# EAGLE design Mini-Mixer (EAGLE 7.2.0)
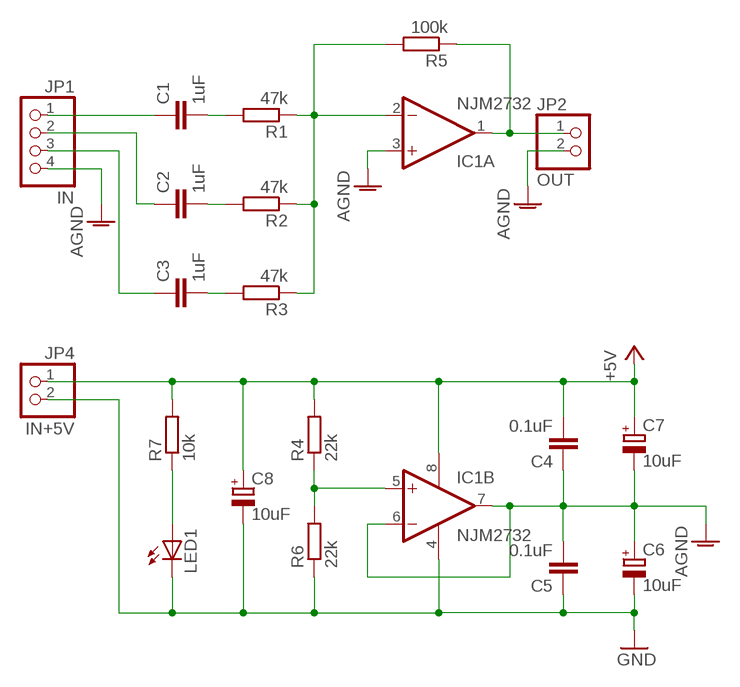
[diagram p0: schematic, sheet 1]

## Parts
C1  1uF  C-EU050-050X075  [C050-050X075]
C2  1uF  C-EU050-050X075  [C050-050X075]
C3  1uF  C-EU050-050X075  [C050-050X075]
C4  0.1uF  C-EU025-024X044  [C025-024X044]
C5  0.1uF  C-EU025-024X044  [C025-024X044]
C6  10uF  CPOL-EUTT2D4L  [TT2D4L]
C7  10uF  CPOL-EUTT2D4L  [TT2D4L]
C8  10uF  CPOL-EUTT2D4L  [TT2D4L]
IC1  NJM2732  LM4558N  [DIL08]
JP1  IN  PINHD-1X4  [1X04]
JP2  OUT  PINHD-1X2  [1X02]
JP4  IN+5V  PINHD-1X2  [1X02]
LED1  LED3MM  [LED3MM]
R1  47k  R-EU_0207/7  [0207/7]
R2  47k  R-EU_0207/7  [0207/7]
R3  47k  R-EU_0207/7  [0207/7]
R4  22k  R-EU_0207/7  [0207/7]
R5  100k  R-EU_0207/7  [0207/7]
R6  22k  R-EU_0207/7  [0207/7]
R7  10k  R-EU_0207/7  [0207/7]

## Nets
+5V: C4.2 C7.+ C8.+ IC1.8(P:V+) JP4.1 R4.2 R7.2
AGND: C4.1 C5.2 C6.+ C7.- IC1.3(A:+IN) IC1.6(B:-IN) IC1.7(B:OUT) JP1.4 JP2.2
GND: C5.1 C6.- C8.- IC1.4(P:V-) JP4.2 LED1.K(C) R6.1
N$1: C1.1 JP1.1
N$2: C2.1 JP1.2
N$3: C3.1 JP1.3
N$4: C1.2 R1.2
N$5: C2.2 R2.2
N$6: C3.2 R3.2
N$7: IC1.2(A:-IN) R1.1 R2.1 R3.1 R5.2
N$8: LED1.A R7.1
N$9: IC1.1(A:OUT) JP2.1 R5.1
N$11: IC1.5(B:+IN) R4.1 R6.2

## Library data of the parts
C1-C5 = rcl:C-EU: CAPACITOR, European symbol
C6-C8 = rcl:CPOL-EU: POLARIZED CAPACITOR, European symbol
IC1 = linear:*4558: OP AMP
JP1 = pinhead:PINHD-1X4: PIN HEADER
JP2 JP4 = pinhead:PINHD-1X2: PIN HEADER
LED1 = led:LED: LED OSRAM: - CHIPLED LG R971, LG N971, LY N971, LG Q971, LY Q971, LO R971, LY R971 LH N974, LH R974 LS Q976, LO Q976, LY Q976 LO Q996 - Hyper CHIPLED LW Q18S LB Q993, LB Q99A, LB R99A - SideLED LS A670, LO A670, LY A670, LG A670, LP A670 LB A673, LV A673, LT A673, LW A673 LH A674 LY A675 LS A676, LA A676, LO A676, LY A676, LW A676 LS A679, LY A679, LG A679 - Hyper Micro SIDELED® LS Y876, LA Y876, LO Y876, LY Y876 LT Y87S - SmartLED LW L88C, LW L88S LB L89C, LB L89S, LG L890 LS L89K, LO L89K, LY L89K LS L896, LA L896, LO L896, LY L896 - TOPLED LS T670, LO T670, LY T670, LG T670, LP T670 LSG T670, LSP T670, LSY T670, LOP T670, LYG T670 LG T671, LOG T671, LSG T671 LB T673, LV T673, LT T673, LW T673 LH T674 LS T676, LA T676, LO T676, LY T676, LB T676, LH T676, LSB T676, LW T676 LB T67C, LV T67C, LT T67C, LS T67K, LO T67K, LY T67K, LW E67C LS E67B, LA E67B, LO E67B, LY E67B, LB E67C, LV E67C, LT E67C LW T67C LS T679, LY T679, LG T679 LS T770, LO T770, LY T770, LG T770, LP T770 LB T773, LV T773, LT T773, LW T773 LH T774 LS E675, LA E675, LY E675, LS T675 LS T776, LA T776, LO T776, LY T776, LB T776 LHGB T686 LT T68C, LB T68C - Hyper Mini TOPLED® LB M676 - Mini TOPLED Santana® LG M470 LS M47K, LO M47K, LY M47K Source: http://www.osram.convergy.de LUXEON: - LUMILED® LXK2-PW12-R00, LXK2-PW12-S00, LXK2-PW14-U00, LXK2-PW14-V00 LXK2-PM12-R00, LXK2-PM12-S00, LXK2-PM14-U00 LXK2-PE12-Q00, LXK2-PE12-R00, LXK2-PE12-S00, LXK2-PE14-T00, LXK2-PE14-U00 LXK2-PB12-K00, LXK2-PB12-L00, LXK2-PB12-M00, LXK2-PB14-N00, LXK2-PB14-P00, LXK2-PB14-Q00 LXK2-PR12-L00, LXK2-PR12-M00, LXK2-PR14-Q00, LXK2-PR14-R00 LXK2-PD12-Q00, LXK2-PD12-R00, LXK2-PD12-S00 LXK2-PH12-R00, LXK2-PH12-S00 LXK2-PL12-P00, LXK2-PL12-Q00, LXK2-PL12-R00 Source: www.luxeon.com KINGBRIGHT: KA-3528ASYC Source: www.kingbright.com
R1-R7 = rcl:R-EU_: RESISTOR, European symbol

## Board
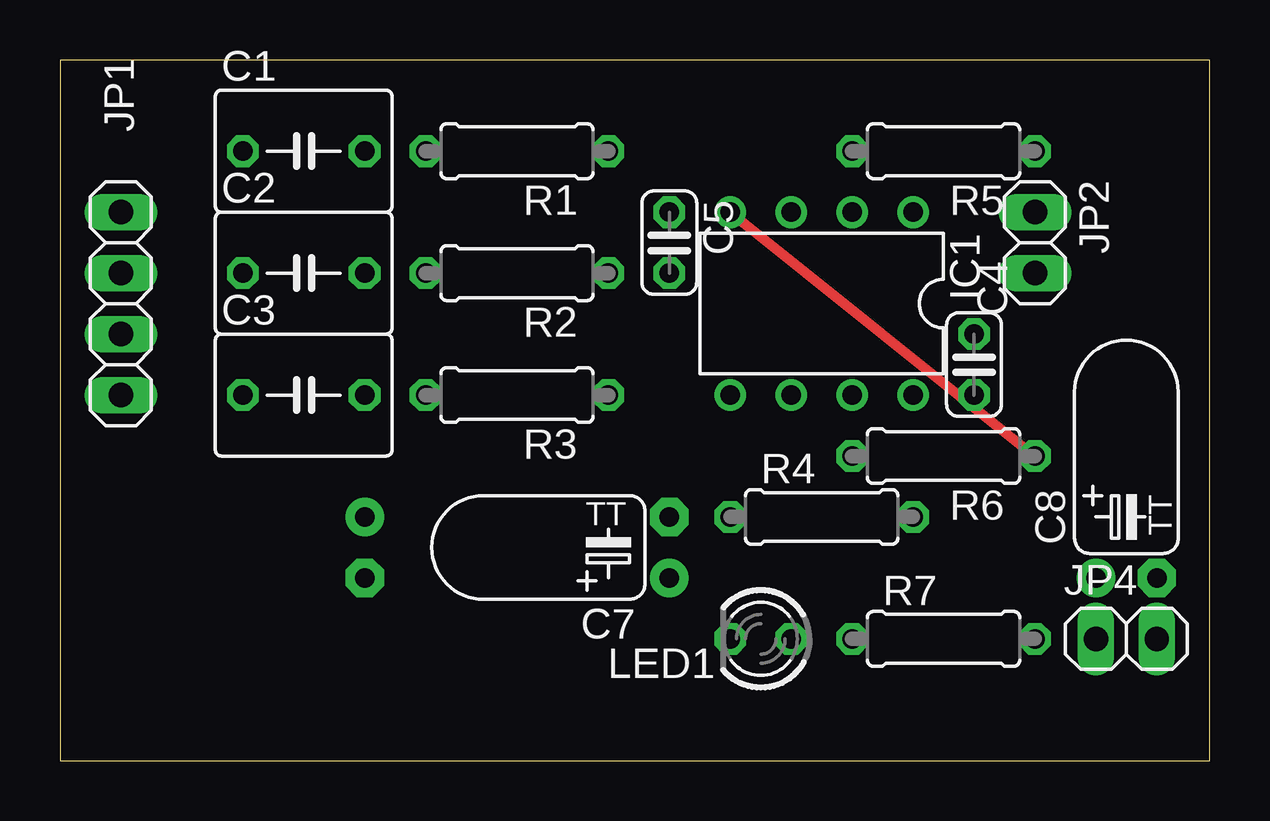
[diagram p1: board, top side]
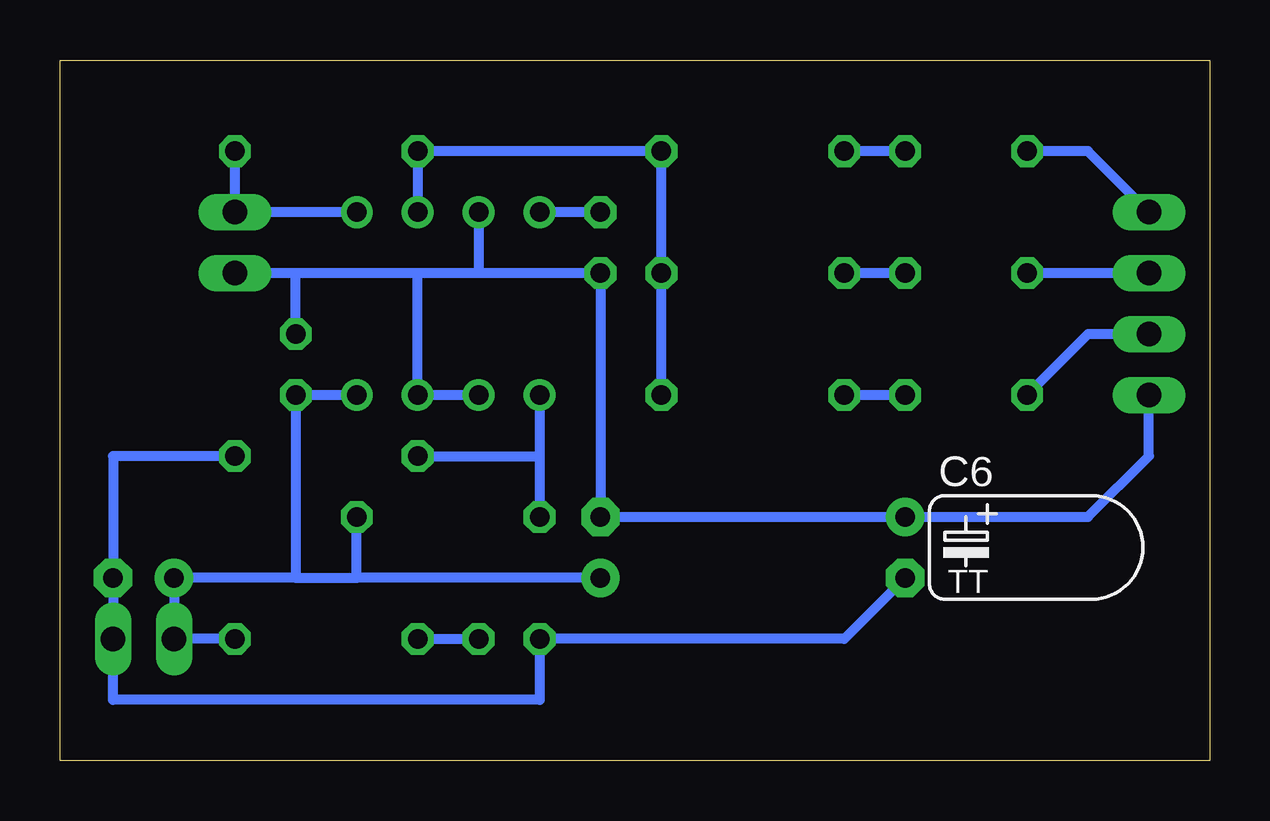
[diagram p2: board, bottom side, seen from below]

Size 47.93 x 29.2 mm. Coordinates in mm from the lower left corner, seen from the top.
Outline: 0,0 47.93,0 47.93,29.2 0,29.2 0,0
Copper layers (1*16): Top 0.035mm / dielectric 1.5mm / Bottom 0.035mm
Design rules "default": minimum track width 10mil, minimum drill 24mil, track to track 8mil, track to pad 8mil, pad to pad 8mil, via to via 8mil, smd to smd 8mil, copper to edge 40mil, drill to drill 8mil, minimum pad ring 10mil, minimum via ring 8mil, stop-mask expansion 4mil, vias tented up to drill 0mil, thermal gap 10mil
tRestrict: area 19.1,26.7 to 47,29.2

### Footprints (pad centres in the part's own frame; a part is rotated, then mirrored left to right if it is on the bottom)
C050-050X075 = drill 0.813 octagon: 1 -2.54,0; 2 2.54,0
C025-024X044 = drill 0.813 octagon: 1 -1.27,0; 2 1.27,0
TT2D4L = drill 0.813 pad 1.6: + -1.27,0 | drill 0.813 pad 1.6 octagon: - 1.27,0
DIL08 = drill 0.813 pad 1.27: 1 -3.81,-3.81; 2 -1.27,-3.81; 3 1.27,-3.81; 4 3.81,-3.81; 5 3.81,3.81; 6 1.27,3.81; 7 -1.27,3.81; 8 -3.81,3.81
1X04 = drill 1.016 long: 1 -3.81,0; 2 -1.27,0; 3 1.27,0; 4 3.81,0
1X02 = drill 1.016 long: 1 -1.27,0; 2 1.27,0
LED3MM = drill 0.813 octagon: A -1.27,0; K 1.27,0
0207/7 = drill 0.813 octagon: 1 -3.81,0; 2 3.81,0

### Placement (x,y rotation side)
C1  10.16,25.4 0 top
C2  10.16,20.32 0 top
C3  10.16,15.24 0 top
C4  38.1,16.51 270 top
C5  25.4,21.59 270 top
C6  12.7,8.89 270 bottom
C7  25.4,8.89 90 top
C8  44.45,7.62 0 top
IC1  31.75,19.05 180 top
JP1  2.54,19.05 270 top
JP2  40.64,21.59 270 top
JP4  44.45,5.08 0 top
LED1  29.21,5.08 180 top
R1  19.05,25.4 180 top
R2  19.05,20.32 180 top
R3  19.05,15.24 180 top
R4  31.75,10.16 0 top
R5  36.83,25.4 180 top
R6  36.83,12.7 180 top
R7  36.83,5.08 0 top

### Tracks (layer width: path | path; a pad name or v marks a point on that pad's centre or on a via)
+5V
  Bottom 0.406: C7.+ 35.56,7.62 | 35.56,7.62 R4.2 | R7.2 JP4.1 C8.+ 38.1,7.62 | 38.1,7.62 35.56,7.62 | IC1.8 C4.2 38.1,7.62
AGND
  Bottom 0.406: 30.48,20.32 C5.2 C7.- C6.+ 5.08,10.16 2.54,12.7 JP1.4 | 30.48,20.32 33.02,20.32 | 33.02,20.32 38.1,20.32 | 38.1,20.32 JP2.2 | IC1.3 30.48,20.32 | C4.1 38.1,20.32 | IC1.6 IC1.7 33.02,20.32
GND
  Top 0.406: IC1.4 R6.1
  Bottom 0.406: C5.1 IC1.4 | C6.- 15.24,5.08 LED1.K 27.94,2.54 45.72,2.54 JP4.2 C8.- 45.72,12.7 R6.1
N$1
  Bottom 0.406: JP1.1 5.08,25.4 C1.1
N$2
  Bottom 0.406: JP1.2 C2.1
N$3
  Bottom 0.406: JP1.3 5.08,17.78 C3.1
N$4
  Bottom 0.406: C1.2 R1.2
N$5
  Bottom 0.406: C2.2 R2.2
N$6
  Bottom 0.406: C3.2 R3.2
N$7
  Bottom 0.406: R3.1 R2.1 R1.1 R5.2 IC1.2
N$8
  Bottom 0.406: R7.1 LED1.A
N$9
  Bottom 0.406: IC1.1 JP2.1 R5.1
N$11
  Bottom 0.406: IC1.5 27.94,12.7 | 27.94,12.7 R4.1 | R6.2 27.94,12.7